# Altium schematic sheet Unused.SchDoc
size Tabloid
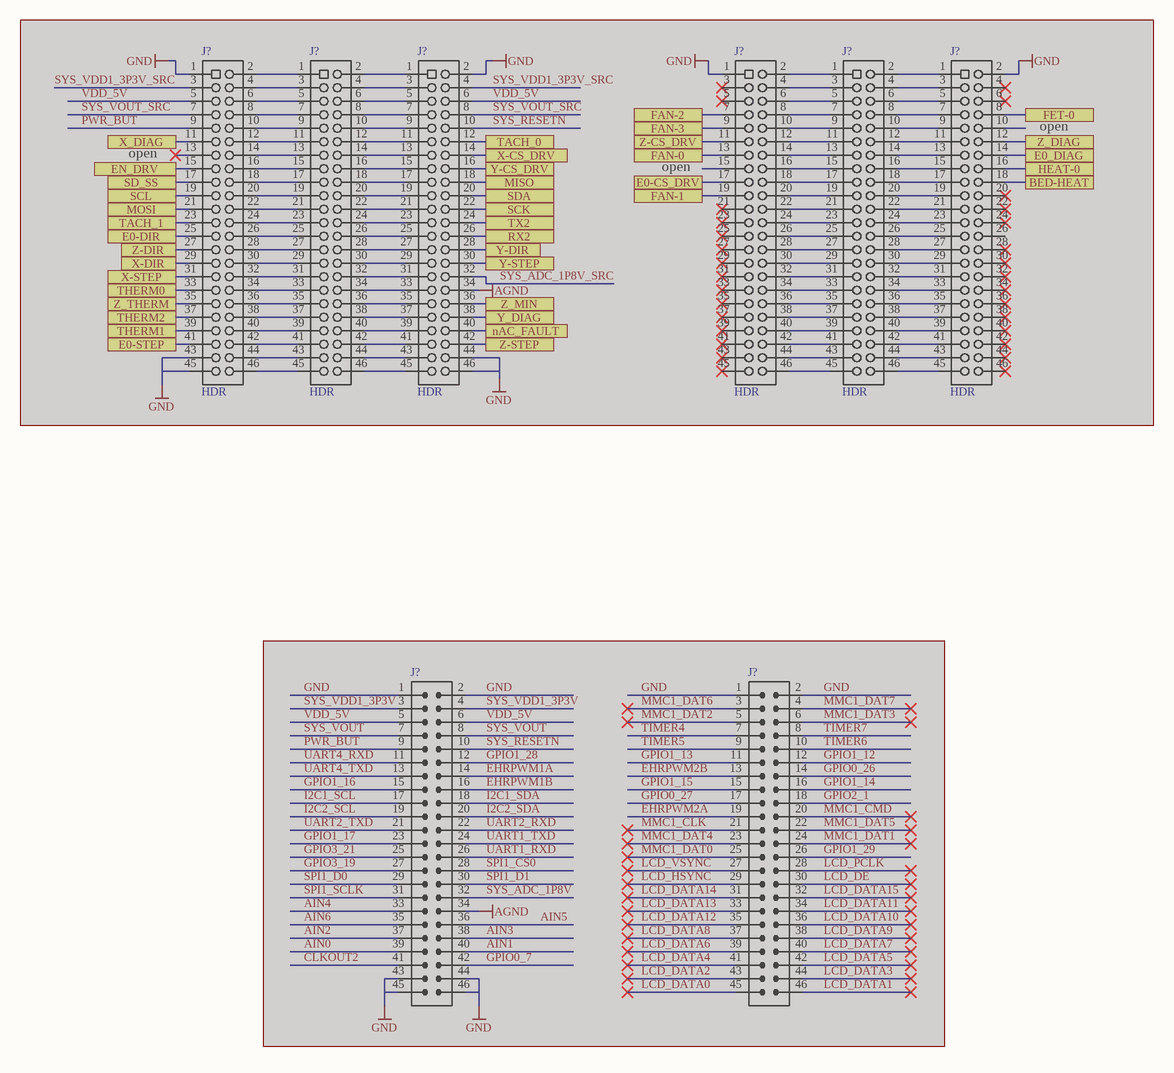
[diagram p0: Unused.SchDoc]

## Parts
(Parts that share a designator on the sheet are numbered #1, #2 ... from top to bottom, then left to right.)
J?#1  HDR  [HDR2X23]  (masked out: inside a compile mask, not in the netlist)
J?#2  HDR  [HDR2X23_ALT_PINOUT]  (masked out: inside a compile mask, not in the netlist)
J?#3  HDR  [HDR2X23]  (masked out: inside a compile mask, not in the netlist)
J?#4  HDR  [HDR2X23]  (masked out: inside a compile mask, not in the netlist)
J?#5  HDR  [HDR2X23_ALT_PINOUT]  (masked out: inside a compile mask, not in the netlist)
J?#6  HDR  [HDR2X23]  (masked out: inside a compile mask, not in the netlist)
J?#7  HDR46  (value not drawn)  (masked out: inside a compile mask, not in the netlist)
J?#8  HDR46  (value not drawn)  (masked out: inside a compile mask, not in the netlist)

## Ports
BED-HEAT, E0-CS_DRV, E0-DIR, E0-STEP, E0_DIAG, EN_DRV, FAN-0, FAN-1, FAN-2, FAN-3, FET-0, HEAT-0, MISO, MOSI, nAC_FAULT, RX2, SCK, SCL, SD_SS, SDA, TACH_0, TACH_1, THERM0, THERM1, THERM2, TX2, X-CS_DRV, X-DIR, X-STEP, X_DIAG, Y-CS_DRV, Y-DIR, Y-STEP, Y_DIAG, Z-CS_DRV, Z-DIR, Z-STEP, Z_DIAG, Z_MIN, Z_THERM

## Notes on the sheet
- (near J?#1) open
- (near J?#4) open
- (near J?#6) open
- Title:
- Project:
- Drawn by:
- Sheet:
- of

## Library data of the parts
J?#1-J?#6 = Header 2X23 Male Pin: CONN HEADER .100" DUAL STR 46POS; MANUFACTURER #: PRPC023DAAN-RC; MANUFACTURER: Sullins; PART DESCRIPTION: 46 Positions Header, Breakaway Connector 0.100" (2.54mm) Through Hole Gold; TOLERANCE: -NA-; DISTRIBUTOR #: S2011EC-23-ND; DISTRIBUTOR: Newark; VALUE: HDR; EE_SPEC: -NA-
J?#7 J?#8 = CONN 46PIN 0.1" FEMALE DUAL-ROW T-HOLE VERT: MANUFACTURER #: NOTAPART - CONN PLACE HOLDER